# EAGLE design EthernetShield (EAGLE 5.11)
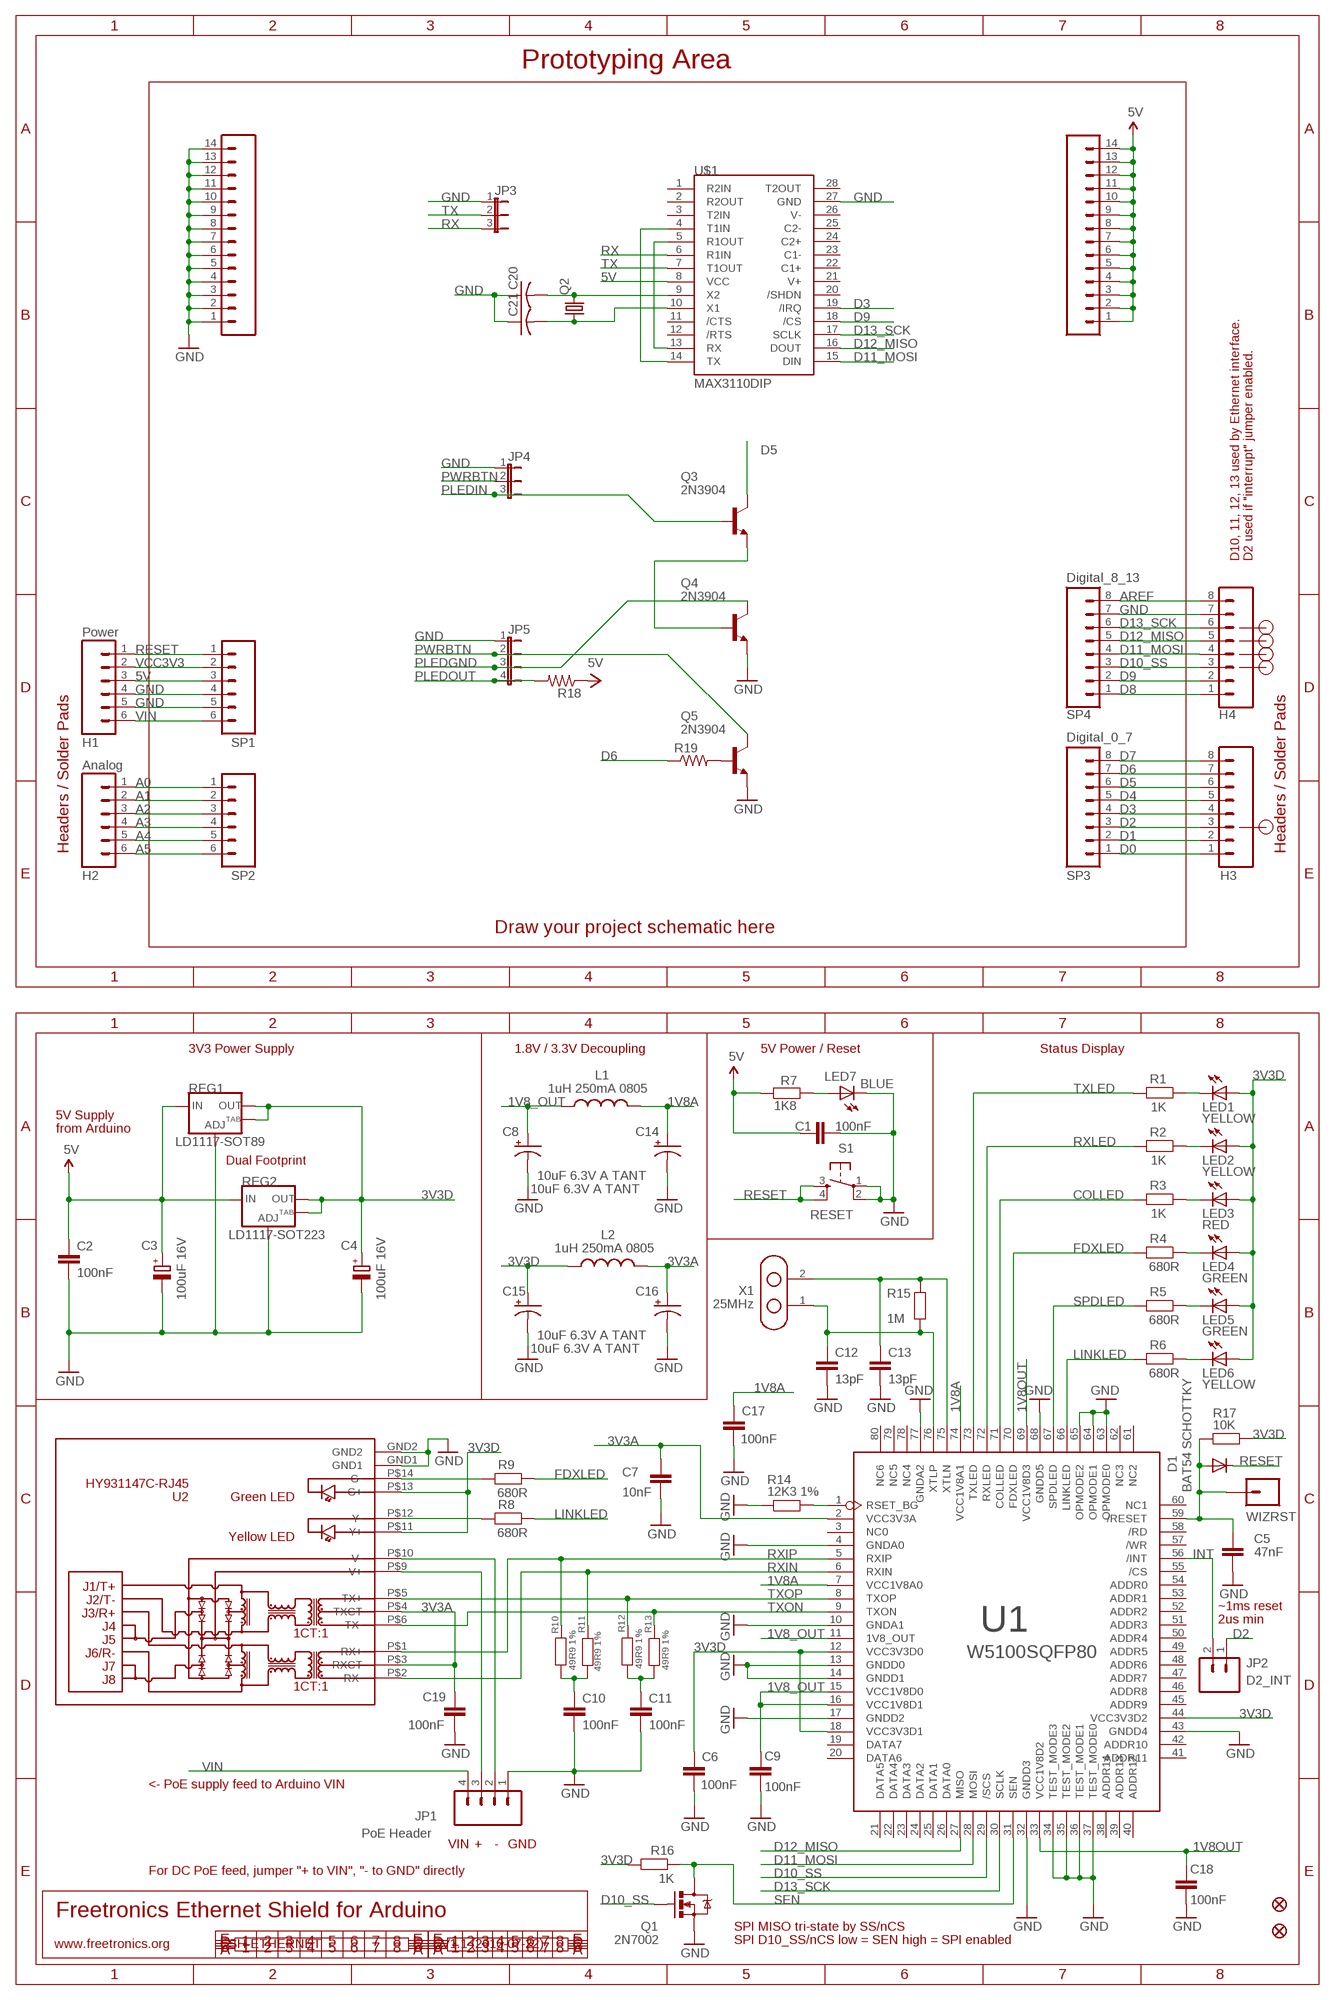
[diagram p0: schematic, sheet 1]

## Parts
C1  100nF  CAP0603  [0603]
C2  100nF  CAP0603  [0603]
C3  100uF 16V  CPOL-EUD  [PANASONIC_D]
C4  100uF 16V  CPOL-EUD  [PANASONIC_D]
C5  47nF  CAP0603  [0603]
C6  100nF  CAP0603  [0603]
C7  10nF  CAP0603  [0603]
C8  10uF 6.3V A TANT  CAP_POL1206  [EIA3216]
C9  100nF  CAP0603  [0603]
C10  100nF  CAP0603  [0603]
C11  100nF  CAP0603  [0603]
C12  13pF  CAP0603  [0603]
C13  13pF  CAP0603  [0603]
C14  10uF 6.3V A TANT  CAP_POL1206  [EIA3216]
C15  10uF 6.3V A TANT  CAP_POL1206  [EIA3216]
C16  10uF 6.3V A TANT  CAP_POL1206  [EIA3216]
C17  100nF  CAP0603  [0603]
C18  100nF  CAP0603  [0603]
C19  100nF  CAP0603  [0603]
C20  C-US050-025X075  [C050-025X075]
C21  C-US050-025X075  [C050-025X075]
D1  BAT54 SCHOTTKY  DIODESOT23  [SOT23-3]
H1  Power  M06SIP  [1X06]
H2  Analog  M06SIP  [1X06]
H3  Digital_0_7  M08  [1X08]
H4  Digital_8_13  M08  [1X08]
JP1  PoE Header  M04PTH  [1X04]
JP2  D2_INT  M02PTH  [1X02]
JP3  JP2E  [JP2]
JP4  JP2E  [JP2]
JP5  JP4E  [JP4]
L1  1uH 250mA 0805  L-USL2012C  [L2012C]
L2  1uH 250mA 0805  L-USL2012C  [L2012C]
LED1  YELLOW  LED0603  [LED-0603]
LED2  YELLOW  LED0603  [LED-0603]
LED3  RED  LED0603  [LED-0603]
LED4  GREEN  LED0603  [LED-0603]
LED5  GREEN  LED0603  [LED-0603]
LED6  YELLOW  LED0603  [LED-0603]
LED7  BLUE  LED0603  [LED-0603]
PADS_5V  M14  [1X14]
PADS_GND  M14  [1X14]
Q1  2N7002  MOSFET-NCHANNELSMD  [SOT23-3]
Q2  CRYSTALHC49U-V  [HC49U-V]
Q3  2N3904  [TO92]
Q4  2N3904  [TO92]
Q5  2N3904  [TO92]
R1  1K  RESISTOR0603  [0603]
R2  1K  RESISTOR0603  [0603]
R3  1K  RESISTOR0603  [0603]
R4  680R  RESISTOR0603  [0603]
R5  680R  RESISTOR0603  [0603]
R6  680R  RESISTOR0603  [0603]
R7  1K8  RESISTOR0603  [0603]
R8  680R  RESISTOR0603  [0603]
R9  680R  RESISTOR0603  [0603]
R10  49R9 1%  RESISTOR0603  [0603]
R11  49R9 1%  RESISTOR0603  [0603]
R12  49R9 1%  RESISTOR0603  [0603]
R13  49R9 1%  RESISTOR0603  [0603]
R14  12K3 1%  RESISTOR0603  [0603]
R15  1M  RESISTOR0603  [0603]
R16  1K  RESISTOR0603  [0603]
R17  10K  RESISTOR0603  [0603]
R18  R-US_0204/5  [0204/5]
R19  R-US_0204/5  [0204/5]
REG1  LD1117-SOT89  V_REG_LM1117SOT89  [SOT89]
REG2  LD1117-SOT223  V_REG_LM1117SOT223  [SOT223]
S1  RESET  TAC_SWITCHSMD  [TACTILE_SWITCH_SMD]
SP1  Power  M06SIP  [1X06]
SP2  Analog  M06SIP  [1X06]
SP3  Digital_0_7  M08  [1X08]
SP4  Digital_8_13  M08  [1X08]
U1  W5100SQFP80  [SQFP80]
U2  HY931147C-RJ45  [HY931147C]
U$1  MAX3110DIP  [DIL28-3]
U$6  FIDUCIAL1X2.5  [FIDUCIAL-1X2.5]
U$8  FIDUCIAL1X2.5  [FIDUCIAL-1X2.5]
WIZRST  M01PTH  [1X01]
X1  25MHz  XTL_B  [XTL_B]

## Nets
1V8_OUT: C8.A(+) C9.1 L1.1 U1.11(1V8_OUT) U1.15(VCC1V8D0) U1.16(VCC1V8D1)
1V8A: C14.A(+) C17.1 L1.2 U1.7(VCC1V8A0) U1.74(VCC1V8A1)
1V8OUT: C18.1 U1.33(VCC1V8D2) U1.69(VCC1V8D3)
3V3A: C7.1 C16.A(+) C19.1 L2.2 U1.2(VCC3V3A) U2.P$3(RXCT) U2.P$4(TXCT)
3V3D: C4.+ C6.1 C15.A(+) L2.1 LED1.A LED2.A LED3.A LED4.A LED5.A LED6.A R16.2 R17.1 REG1.2(OUT) REG1.4(OUT) REG2.2(OUT) REG2.4(OUT) U1.12(VCC3V3D0) U1.18(VCC3V3D1) U1.44(VCC3V3D2) U2.P$11(Y+) U2.P$13(G+)
5V: C1.1 C2.1 C3.+ H1.3 PADS_5V.1 PADS_5V.2 PADS_5V.3 PADS_5V.4 PADS_5V.5 PADS_5V.6 PADS_5V.7 PADS_5V.8 PADS_5V.9 PADS_5V.10 PADS_5V.11 PADS_5V.12 PADS_5V.13 PADS_5V.14 R7.1 REG1.3(IN) REG2.3(IN) SP1.3 U$1.8(VCC)
A0: H2.1 SP2.1
A1: H2.2 SP2.2
A2: H2.3 SP2.3
A3: H2.4 SP2.4
A4: H2.5 SP2.5
A5: H2.6 SP2.6
AREF: H4.8 SP4.8
COLLED: R3.2 U1.71(COLLED)
D0: H3.1 SP3.1
D1: H3.2 SP3.2
D2: H3.3 JP2.1 SP3.3
D3: H3.4 SP3.4 U$1.19(/IRQ)
D4: H3.5 SP3.5
D5: H3.6 Q3.1(C) SP3.6
D6: H3.7 R19.1 SP3.7
D7: H3.8 SP3.8
D8: H4.1 SP4.1
D9: H4.2 SP4.2 U$1.18(/CS)
D10_SS: H4.3 Q1.1(G) SP4.3 U1.29(/SCS)
D11_MOSI: H4.4 SP4.4 U1.28(MOSI) U$1.15(DIN)
D12_MISO: H4.5 SP4.5 U1.27(MISO) U$1.16(DOUT)
D13_SCK: H4.6 SP4.6 U1.30(SCLK) U$1.17(SCLK)
FDXLED: R4.2 R9.1 U1.70(FDXLED)
GND: C1.2 C2.2 C3.- C4.- C5.2 C6.2 C7.2 C8.C(-) C9.2 C10.2 C11.2 C12.2 C13.2 C14.C(-) C15.C(-) C16.C(-) C17.2 C18.2 C19.2 C20.1 C21.1 H1.4 H1.5 H4.7 JP1.1 JP3.1 JP4.1 JP5.1 LED7.C PADS_GND.1 PADS_GND.2 PADS_GND.3 PADS_GND.4 PADS_GND.5 PADS_GND.6 PADS_GND.7 PADS_GND.8 PADS_GND.9 PADS_GND.10 PADS_GND.11 PADS_GND.12 PADS_GND.13 PADS_GND.14 Q1.2(S) Q4.3(E) Q5.3(E) R14.1 REG1.1(ADJ) REG2.1(ADJ) S1.1 S1.2 SP1.4 SP1.5 SP4.7 U1.4(GNDA0) U1.10(GNDA1) U1.13(GNDD0) U1.14(GNDD1) U1.17(GNDD2) U1.32(GNDD3) U1.34(TEST_MODE3) U1.35(TEST_MODE2) U1.36(TEST_MODE1) U1.37(TEST_MODE0) U1.43(GNDD4) U1.63(OPMODE0) U1.64(OPMODE1) U1.65(OPMODE2) U1.68(GNDD5) U1.77(GNDA2) U2.GND1 U2.GND2 U$1.27(GND)
INT: JP2.2 U1.56(/INT)
LINKLED: R6.2 R8.1 U1.66(LINKLED)
N$1: C11.1 R12.1 R13.2
N$2: U$1.4(T1IN) U$1.14(TX)
N$6: U$1.5(R1OUT) U$1.13(RX)
N$7: C20.2 Q2.2 U$1.9(X2)
N$53: C21.2 Q2.1 U$1.10(X1)
N$54: Q3.3(E) Q4.2(B)
N$55: Q5.2(B) R19.2
N$67: R9.2 U2.P$14(G-)
N$68: JP1.3 U2.P$9(V+)
N$69: JP1.2 U2.P$10(V-)
N$70: C5.1 D1.1(A) R17.2 U1.59(/RESET) WIZRST.1
N$131: LED7.A R7.2
N$321: C10.1 R10.1 R11.2
N$322: R14.2 U1.1(RSET_BG)
N$323: LED5.C R5.1
N$325: LED6.C R6.1
N$327: LED4.C R4.1
N$328: LED3.C R3.1
N$329: LED2.C R2.1
N$330: LED1.C R1.1
N$332: R8.2 U2.P$12(Y-)
PLEDGND: JP5.3 Q4.1(C)
PLEDIN: JP4.3 Q3.2(B)
PLEDOUT: JP5.4 R18.2
PWRBTN: JP4.2 JP5.2 Q5.1(C)
RESET: D1.3(C) H1.1 S1.3 S1.4 SP1.1
RX: JP3.3 U$1.6(R1IN)
RXIN: R11.1 U1.6(RXIN) U2.P$2(RX-)
RXIP: R10.2 U1.5(RXIP) U2.P$1(RX+)
RXLED: R2.2 U1.72(RXLED)
SEN: Q1.3(D) R16.1 U1.31(SEN)
SPDLED: R5.2 U1.67(SPDLED)
TX: JP3.2 U$1.7(T1OUT)
TXLED: R1.2 U1.73(TXLED)
TXON: R13.1 U1.9(TXON) U2.P$6(TX-)
TXOP: R12.2 U1.8(TXOP) U2.P$5(TX+)
VCC: R18.1 ; supply symbol labelled 5V
VCC3V3: H1.2 SP1.2
VIN: H1.6 JP1.4 SP1.6
XTLN: C13.1 R15.2 U1.75(XTLN) X1.2
XTLP: C12.1 R15.1 U1.76(XTLP) X1.1
Unconnected: U1.3(NC0) U1.19(DATA7) U1.20(DATA6) U1.21(DATA5) U1.22(DATA4) U1.23(DATA3) U1.24(DATA2) U1.25(DATA1) U1.26(DATA0) U1.38(ADDR14) U1.39(ADDR13) U1.40(ADDR12) U1.41(ADDR11) U1.42(ADDR10) U1.45(ADDR9) U1.46(ADDR8) U1.47(ADDR7) U1.48(ADDR6) U1.49(ADDR5) U1.50(ADDR4) U1.51(ADDR3) U1.52(ADDR2) U1.53(ADDR1) U1.54(ADDR0) U1.55(/CS) U1.57(/WR) U1.58(/RD) U1.60(NC1) U1.61(NC2) U1.62(NC3) U1.78(NC4) U1.79(NC5) U1.80(NC6) U$1.1(R2IN) U$1.2(R2OUT) U$1.3(T2IN) U$1.11(/CTS) U$1.12(/RTS) U$1.20(/SHDN) U$1.21(V+) U$1.22(C1+) U$1.23(C1-) U$1.24(C2+) U$1.25(C2-) U$1.26(V-) U$1.28(T2OUT)

## Notes on the sheet
- Prototyping Area
- D10, 11, 12, 13 used by Ethernet interface. | D2 used if "interrupt" jumper enabled.
- Headers / Solder Pads | Headers / Solder Pads
- Draw your project schematic here
- 3V3 Power Supply | 1.8V / 3.3V Decoupling | 5V Power / Reset | Status Display
- 5V Supply
- from Arduino
- Dual Footprint
- ~1ms reset
- 2us min
- <- PoE supply feed to Arduino VIN
- VIN | + | - | GND
- For DC PoE feed, jumper "+ to VIN", "- to GND" directly
- Freetronics Ethernet Shield for Arduino
- SPI MISO tri-state by SS/nCS
- SPI D10_SS/nCS low = SEN high = SPI enabled
- www.freetronics.org | SH-ETHERNET | V1.1 (2010-07-22)

## Library data of the parts
C1 C2 C5-C7 C9-C13 C17-C19 = freetronics:CAP: Capacitor Standard 0603 ceramic capacitor, and 0.1" leaded capacitor.
C3 C4 = rcl:CPOL-EU: POLARIZED CAPACITOR, European symbol
C8 C14-C16 = freetronics:CAP_POL: Capacitor Polarized These are standard SMD and PTH capacitors. Normally 10uF, 47uF, and 100uF in electrolytic and tantalum varieties. Always verify the external diameter of the through hole cap, it varies with capacity, voltage, and manufacturer. The EIA devices should be standard.
C20 C21 = rcl-2:C-US: CAPACITOR, American symbol
D1 = freetronics:DIODE: Diode These are standard reverse protection diodes and small signal diodes. SMA package can handle up to about 1A. SOD-323 can handle about 200mA. What the SOD-323 package when ordering, there are some mfgs out there that are 5-pin packages.
H1 H2 SP1 SP2 = freetronics:M06: Header 6 Standard 6-pin 0.1" header. Use with straight break away headers (SKU : PRT-00116), right angle break away headers (PRT-00553), swiss pins (PRT-00743), machine pins (PRT-00117), and female headers (PRT-00115). Molex polarized connector foot print use with SKU : PRT-08094 with associated crimp pins and housings. NOTES ON THE VARIANTS LOCK and LOCK_LONGPADS... This footprint was designed to help hold the alignment of a through-hole component (i.e. 6-pin header) while soldering it into place. You may notice that each hole has been shifted either up or down by 0.005 of an inch from it's more standard position (which is a perfectly straight line). This slight alteration caused the pins (the squares in the middle) to touch the edges of the holes. Because they are alternating, it causes a "brace" to hold the component in place. 0.005 has proven to be the perfect amount of "off-center" position when using our standard breakaway headers. Although looks a little odd when you look at the bare footprint, once you have a header in there, the alteration is very hard to notice. Also, if you push a header all the way into place, it is covered up entirely on the bottom side. This idea of altering the position of holes to aid alignment will be further integrated into the Sparkfun Library for other footprints. It can help hold any component with 3 or more connection pins.
H3 H4 SP3 SP4 = freetronics:M08: Header 8 Standard 8-pin 0.1" header. Use with straight break away headers (SKU : PRT-00116), right angle break away headers (PRT-00553), swiss pins (PRT-00743), machine pins (PRT-00117), and female headers (PRT-00115).
JP1 = freetronics:M04: Header 4 Standard 4-pin 0.1" header. Use with straight break away headers (SKU : PRT-00116), right angle break away headers (PRT-00553), swiss pins (PRT-00743), machine pins (PRT-00117), and female headers (PRT-00115). Molex polarized connector foot print use with SKU : PRT-08231 with associated crimp pins and housings.
JP2 = freetronics:M02: Header 2 Standard 2-pin 0.1" header. Use with straight break away headers (SKU : PRT-00116), right angle break away headers (PRT-00553), swiss pins (PRT-00743), machine pins (PRT-00117), and female headers (PRT-00115). Molex polarized connector foot print use with SKU : PRT-08233 with associated crimp pins and housings.
JP3 JP4 = jumper:JP2E: JUMPER
JP5 = jumper:JP4E: JUMPER
L1 L2 = rcl:L-US: INDUCTOR, American symbol
LED1-LED7 = freetronics:LED: LEDs Standard schematic elements and footprints for 5mm, 3mm, 1206, and 0603 sized LEDs. 5mm - Spark Fun Electronics SKU : COM-00529 (and others)
PADS_5V PADS_GND = freetronics:M14: Header 14 Standard 14-pin 0.1" header. Use with straight break away headers (SKU : PRT-00116), right angle break away headers (PRT-00553), swiss pins (PRT-00743), machine pins (PRT-00117), and female headers (PRT-00115).
Q1 = freetronics:MOSFET-NCHANNEL
Q2 = crystal:CRYSTAL: CRYSTAL
Q3-Q5 = transistor-npn:2N3904: NPN Transistor
R1-R17 = freetronics:RESISTOR: Resistor Basic schematic elements and footprints for 0603, 1206, and PTH 1/10th watt (small) resistors.
R18 R19 = resistor:R-US_: RESISTOR, American symbol
REG1 REG2 = freetronics:V_REG_LM1117: Voltage Regulator LD1117 Adjustable low-dropout voltage regulator available in SOT89 and SOT223 SMT packages.
S1 = freetronics:TAC_SWITCH: Momentary Switch Button commonly used for reset or general input. Spark Fun Electronics SKU : COM-00097
U1 = freetronics-marc:W5100: WIZnet W5100
U2 = freetronics-jon:HY931147C
U$1 = 000-kg4wsv:MAX3110: MAX3110 SPI UART w/RS232 tranceiver
U$6 U$8 = freetronics:FIDUCIAL: Fiducial Alignment Points Various fiducial points for machine vision alignment.
WIZRST = freetronics:M01: Header 1 Standard 1-pin 0.1" header. Use with straight break away headers (SKU : PRT-00116), right angle break away headers (PRT-00553), swiss pins (PRT-00743), machine pins (PRT-00117), and female headers (PRT-00115).
X1 = CPT_CJ:XTL_B

## Board
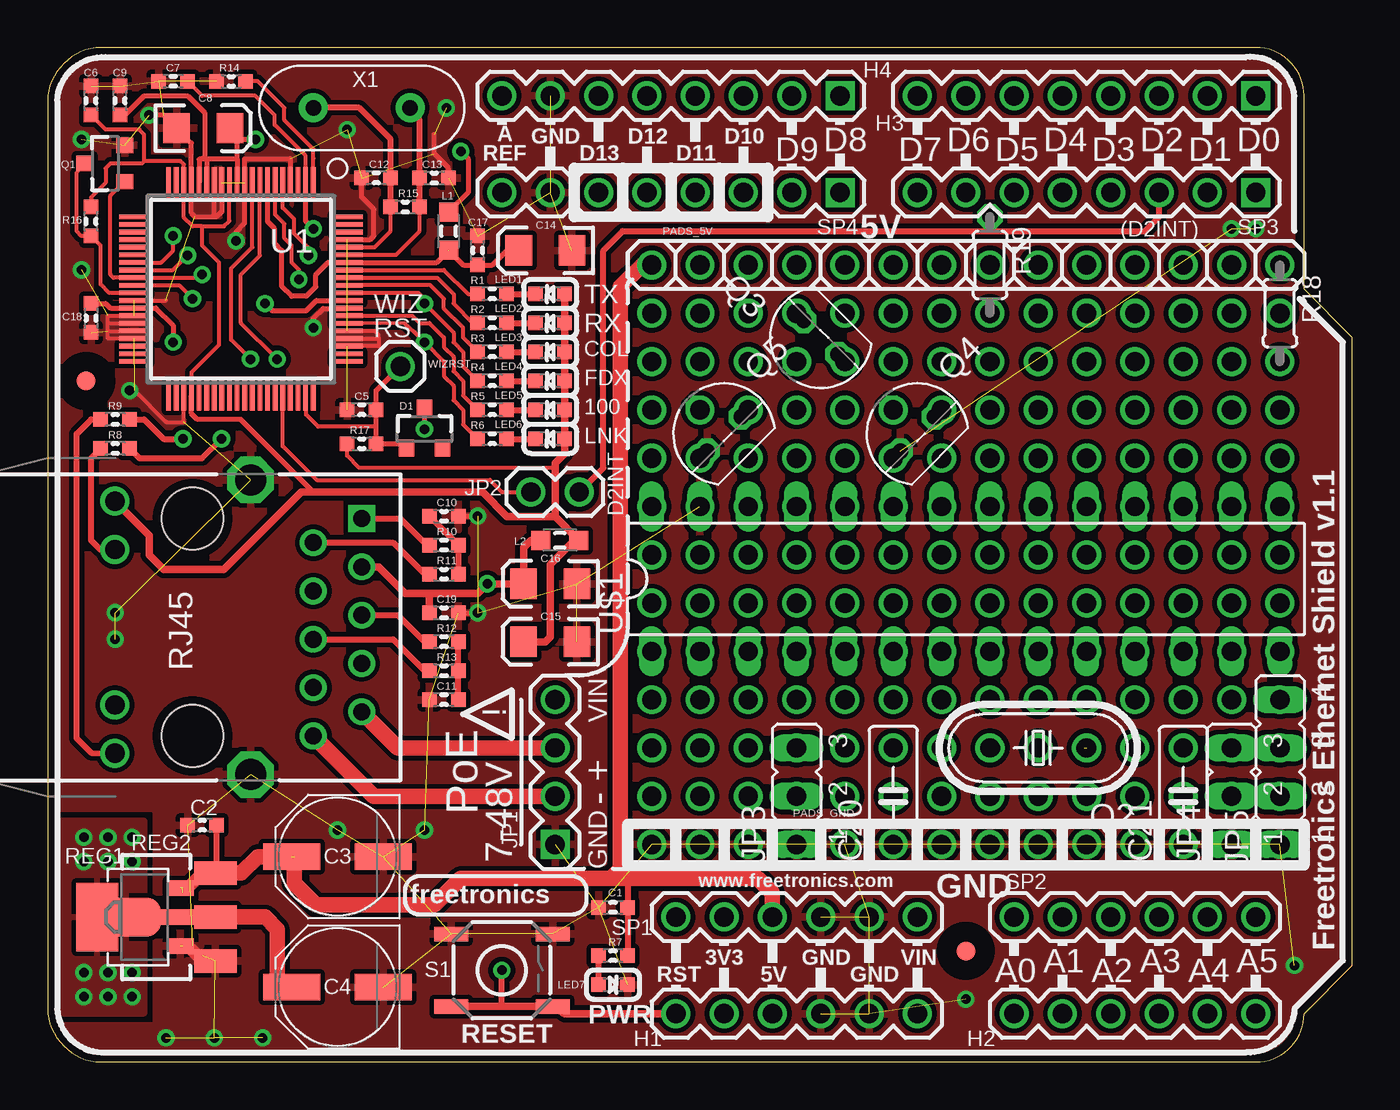
[diagram p1: board, top side]
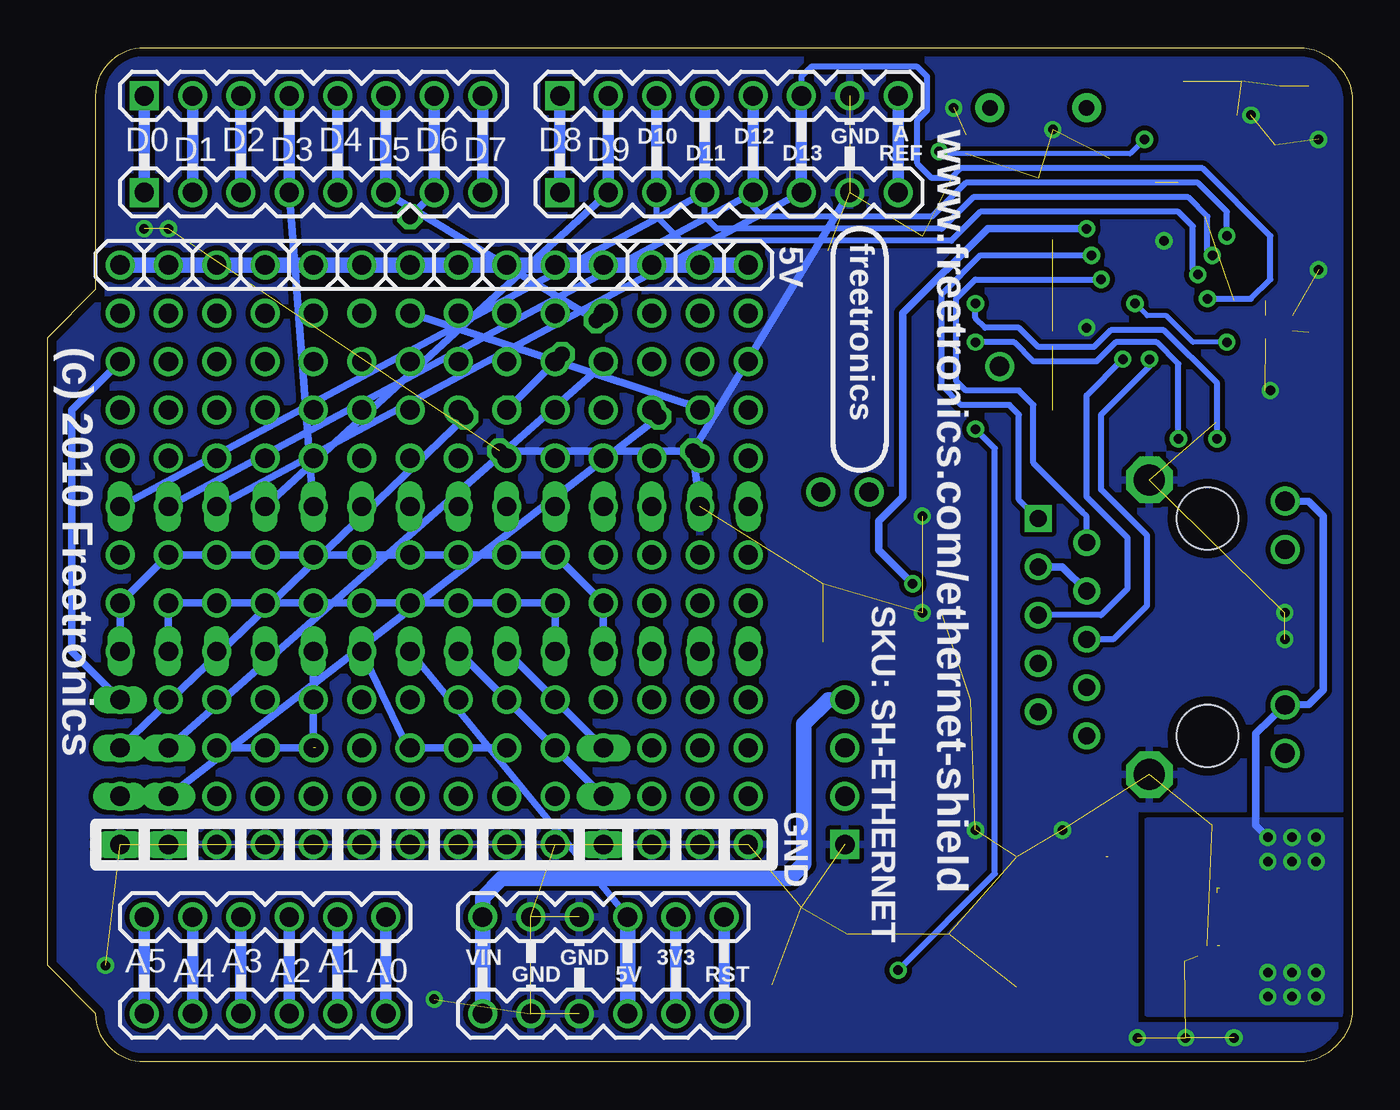
[diagram p2: board, bottom side, seen from below]

Size 68.58 x 53.34 mm. Coordinates in mm from the lower left corner, seen from the top.
Outline: 0,2.54 arc74 2.54,0 63.5,0 arc90 66.04,2.54 68.58,5.08 68.58,38.1 66.04,40.64 66.04,50.8 arc90 63.5,53.34 2.54,53.34 arc74 0,50.8 0,2.54
Copper layers (1*16): Top 0.035mm / dielectric 1.5mm / Bottom 0.035mm
Design rules "default *": minimum track width 8mil, minimum drill 18mil, track to track 10mil, track to pad 10mil, pad to pad 10mil, via to via 10mil, smd to smd 8mil, copper to edge 18mil, drill to drill 8mil, minimum pad ring 10mil, minimum via ring 8mil, stop-mask expansion 4mil, vias tented up to drill 25mil, thermal gap 10mil
tRestrict: area 1,34.8 to 3,36.8; area 47.2,4.8 to 49.3,6.9

### Footprints (pad centres in the part's own frame; a part is rotated, then mirrored left to right if it is on the bottom)
0603 = smd 0.762 x 0.762: 1 -0.762,0; 2 0.762,0
PANASONIC_D = smd 3 x 1.4: + 2.4,0; - -2.4,0
EIA3216 = smd 1.4 x 1.6: A 1.4,0; C -1.4,0
C050-025X075 = drill 0.813 octagon: 1 -2.54,0; 2 2.54,0
SOT23-3 = smd 0.8 x 0.9: 1 -0.95,-1; 2 0.95,-1; 3 0,1.1
1X06 = drill 1.016 round: 1 0,0; 2 2.54,0; 3 5.08,0; 4 7.62,0; 5 10.16,0; 6 12.7,0
1X08 = drill 1.016 square: 1 0,0 | drill 1.016 round: 2 2.54,0; 3 5.08,0; 4 7.62,0; 5 10.16,0; 6 12.7,0; 7 15.24,0; 8 17.78,0
1X04 = drill 1.016 square: 1 0,0 | drill 1.016 round: 2 2.54,0; 3 5.08,0; 4 7.62,0
1X02 = drill 1.016 round: 1 0,0; 2 2.54,0
JP2 = drill 0.914 long: 1 -2.54,0; 2 0,0; 3 2.54,0
JP4 = drill 0.914 long: 1 -3.81,0; 2 -1.27,0; 3 1.27,0; 4 3.81,0
L2012C = smd 1 x 1: 1 -1,0; 2 1,0
LED-0603 = smd 0.762 x 0.762: A -0.762,0; C 0.762,0
1X14 = drill 1.016 round: 1 0,0; 2 2.54,0; 3 5.08,0; 4 7.62,0; 5 10.16,0; 6 12.7,0; 7 15.24,0; 8 17.78,0; 9 20.32,0; 10 22.86,0; 11 25.4,0; 12 27.94,0; 13 30.48,0; 14 33.02,0
HC49U-V = drill 0.813 round: 1 -2.413,0; 2 2.413,0
TO92 = drill 0.813 octagon: 1 1.27,0; 2 0,1.905; 3 -1.27,0
0204/5 = drill 0.813 octagon: 1 -2.54,0; 2 2.54,0
SOT89 = smd 0.8 x 1.4: 1 -1.524,-1.905; 3 1.524,-1.905 | smd 0.8 x 1.9: 2 0,-1.651 | smd 2.032 x 3.65: 4 0,0.94
SOT223 = smd 1.219 x 2.235: 1 -2.311,-3.099; 2 0,-3.099; 3 2.311,-3.099 | smd 3.6 x 2.2: 4 0,3.099
TACTILE_SWITCH_SMD = smd 1.778 x 0.762: 1 -2.667,1.905; 2 2.667,1.905; 3 -2.667,-1.905; 4 2.667,-1.905
SQFP80 = smd 1.6 x 0.25: 1 -5.6,3.8; 2 -5.6,3.4; 3 -5.6,3; 4 -5.6,2.6; 5 -5.6,2.2; 6 -5.6,1.8; 7 -5.6,1.4; 8 -5.6,1; 9 -5.6,0.6; 10 -5.6,0.2; 11 -5.6,-0.2; 12 -5.6,-0.6; 13 -5.6,-1; 14 -5.6,-1.4; 15 -5.6,-1.8; 16 -5.6,-2.2; 17 -5.6,-2.6; 18 -5.6,-3; 19 -5.6,-3.4; 20 -5.6,-3.8; 41 5.6,-3.8; 42 5.6,-3.4; 43 5.6,-3; 44 5.6,-2.6; 45 5.6,-2.2; 46 5.6,-1.8; 47 5.6,-1.4; 48 5.6,-1; 49 5.6,-0.6; 50 5.6,-0.2; 51 5.6,0.2; 52 5.6,0.6; 53 5.6,1; 54 5.6,1.4; 55 5.6,1.8; 56 5.6,2.2; 57 5.6,2.6; 58 5.6,3; 59 5.6,3.4; 60 5.6,3.8 | smd 0.25 x 1.6: 21 -3.8,-5.6; 22 -3.4,-5.6; 23 -3,-5.6; 24 -2.6,-5.6; 25 -2.2,-5.6; 26 -1.8,-5.6; 27 -1.4,-5.6; 28 -1,-5.6; 29 -0.6,-5.6; 30 -0.2,-5.6; 31 0.2,-5.6; 32 0.6,-5.6; 33 1,-5.6; 34 1.4,-5.6; 35 1.8,-5.6; 36 2.2,-5.6; 37 2.6,-5.6; 38 3,-5.6; 39 3.4,-5.6; 40 3.8,-5.6; 61 3.8,5.6; 62 3.4,5.6; 63 3,5.6; 64 2.6,5.6; 65 2.2,5.6; 66 1.8,5.6; 67 1.4,5.6; 68 1,5.6; 69 0.6,5.6; 70 0.2,5.6; 71 -0.2,5.6; 72 -0.6,5.6; 73 -1,5.6; 74 -1.4,5.6; 75 -1.8,5.6; 76 -2.2,5.6; 77 -2.6,5.6; 78 -3,5.6; 79 -3.4,5.6; 80 -3.8,5.6
HY931147C = drill 1.63 octagon: GND1 3.05,7.745; GND2 3.05,-7.745 | drill 0.9 square: P$1 8.89,5.715 | drill 0.9 round: P$2 6.35,4.445; P$3 8.89,3.175; P$4 6.35,1.905; P$5 8.89,0.635; P$6 6.35,-0.635; P$7 8.89,-1.905; P$8 6.35,-3.175; P$9 8.89,-4.445; P$10 6.35,-5.715 | drill 1.016 round: P$11 -4.08,6.625; P$12 -4.08,4.085; P$13 -4.08,-4.085; P$14 -4.08,-6.625 | hole 3.25: 0,5.715; 0,-5.715
DIL28-3 = drill 0.813 long: 1 -16.51,-3.81; 2 -13.97,-3.81; 3 -11.43,-3.81; 4 -8.89,-3.81; 5 -6.35,-3.81; 6 -3.81,-3.81; 7 -1.27,-3.81; 8 1.27,-3.81; 9 3.81,-3.81; 10 6.35,-3.81; 11 8.89,-3.81; 12 11.43,-3.81; 13 13.97,-3.81; 14 16.51,-3.81; 15 16.51,3.81; 16 13.97,3.81; 17 11.43,3.81; 18 8.89,3.81; 19 6.35,3.81; 20 3.81,3.81; 21 1.27,3.81; 22 -1.27,3.81; 23 -3.81,3.81; 24 -6.35,3.81; 25 -8.89,3.81; 26 -11.43,3.81; 27 -13.97,3.81; 28 -16.51,3.81
FIDUCIAL-1X2.5 = smd 1 x 1: 1 0,0
1X01 = drill 1.016 round: 1 0,0
XTL_B = drill 0.813 pad 1.524 round: 1 0,2.54; 2 0,-2.54

### Placement (x,y rotation side)
C1  29.72,8.13 180 top
C2  8.13,12.45 180 top
C3  15.24,10.79 180 top
C4  15.24,3.94 180 top
C5  16.51,34.29 180 top
C6  2.29,50.55 90 top
C7  6.6,51.56 180 top
C8  8.18,49.1 0 top
C9  3.81,50.55 90 top
C10  20.83,28.7 0 top
C11  20.83,19.05 180 top
C12  17.27,46.48 180 top
C13  20.32,46.48 0 top
C14  26.16,42.67 180 top
C15  26.42,22.1 180 top
C16  26.42,25.15 180 top
C17  22.61,42.67 90 top
C18  2.29,39.12 270 top
C19  20.83,23.62 0 top
C20  44.45,13.97 90 top
C21  59.69,13.97 90 top
D1  19.81,33.27 0 top
H1  33.02,2.54 0 top
H2  50.8,2.54 0 top
H3  63.5,50.8 180 top
H4  41.66,50.8 180 top
JP1  26.67,11.43 90 top
JP2  27.94,29.97 180 top
JP3  39.37,13.97 90 top
JP4  62.23,13.97 90 top
JP5  64.77,15.24 90 top
L1  21.08,43.69 270 top
L2  26.92,27.43 180 top
LED1  26.42,40.39 180 top
LED2  26.42,38.86 180 top
LED3  26.42,37.34 180 top
LED4  26.42,35.81 180 top
LED5  26.42,34.29 180 top
LED6  26.42,32.77 180 top
LED7  29.72,4.06 0 top
PADS_5V  31.75,41.91 0 top
PADS_GND  31.75,11.43 0 top
Q1  3.05,47.24 90 top
Q2  52.07,16.51 180 top
Q3  40.64,38.1 135 top
Q4  45.72,33.02 45 top
Q5  35.56,33.02 45 top
R1  23.37,40.39 180 top
R2  23.37,38.86 180 top
R3  23.37,37.34 180 top
R4  23.37,35.81 180 top
R5  23.37,34.29 180 top
R6  23.37,32.77 180 top
R7  29.72,5.59 180 top
R8  3.56,32.26 180 top
R9  3.56,33.78 180 top
R10  20.83,27.18 180 top
R11  20.83,25.65 0 top
R12  20.83,22.1 180 top
R13  20.83,20.57 0 top
R14  9.65,51.56 0 top
R15  18.8,44.96 0 top
R16  2.29,44.2 90 top
R17  16.51,32.51 0 top
R18  64.77,39.37 270 top
R19  49.53,41.91 270 top
REG1  5.08,7.62 90 top
REG2  5.71,7.62 90 top
S1  23.88,4.83 0 top
SP1  33.02,7.62 0 top
SP2  50.8,7.62 0 top
SP3  63.5,45.72 180 top
SP4  41.66,45.72 180 top
U1  10.16,40.64 270 top
U2  7.62,22.86 0 top
U$1  48.26,25.4 0 top
U$6  2.03,35.81 0 top
U$8  48.26,5.84 0 top
WIZRST  18.54,36.58 0 top
X1  16.51,50.16 90 top

### Tracks (layer width: path | path; a pad name or v marks a point on that pad's centre or on a via)
1V8_OUT  (via drill 0.5)
  Top 0.254: C9.1 4.06,49.78 5.08,50.8 7.37,50.8 8.26,49.91 8.26,47.47 | 8.26,47.47 7.96,47.46 U1.16 | 9.96,47.5 U1.11 | 9.96,47.5 9.96,48.84 C8.A 10.16,48.51 v10.92,48.51 | 8.23,47.5 8.36,47.5 | 8.36,47.5 9.96,47.5 | U1.15 8.36,47.5 | L1.1 21.08,44.7 22.1,45.72 22.1,47.5 v21.72,47.88 | 8.26,47.47 8.23,47.5 | 8.23,47.5 8.13,47.5
  Bottom 0.254: v10.92,48.51 11.68,47.75 21.59,47.75 v21.72,47.88
1V8A  (1 unrouted)
  Top 0.254: C14.A 24.13,42.67 23.37,41.91 C17.1 21.84,41.91 21.08,42.67 20.45,42.04 U1.74 14.73,42.04 14.1,41.4 14.1,40.77 13.59,40.26 12.83,40.26 12.32,40.77 12.32,42.67 11.94,43.05 11.94,43.81 11.56,44.19 U1.7
1V8OUT  (via drill 0.5)
  Top 0.254: C18.1 3.05,39.88 3.29,39.64 U1.33 5.69,39.65 6.6,38.73 v6.6,37.85 | U1.69 14.13,40.04 13.59,39.5 11.81,39.5 v11.43,39.88
  Bottom 0.254: v11.43,39.88 10.79,39.24 9.78,39.24 8.38,37.85 v6.6,37.85
3V3A  (via drill 0.5)
  Top 0.203: U1.2 13.56,46.27 13.56,47.65 11.94,49.28 11.94,49.78 10.92,50.8 8.13,50.8 C7.1
  Top 0.254: U1.2 13.56,44.22 v13.97,43.81
  Top 0.406: L2.2 25.4,27.43 25.02,27.05 C16.A v23.11,25.15 22.61,24.64 20.07,24.64 | U2.P$3 17.4,26.04 18.8,24.64 20.07,24.64 | 20.07,24.64 C19.1
  Bottom 0.406: U2.P$4 15.24,26.04 U2.P$3 | v13.97,43.81 19.18,43.81 23.62,39.37 23.62,29.72 24.89,28.45 24.89,26.92 v23.11,25.15
3V3D  (via drill 0.5)
  Top 0.203: U1.44 7.57,36.22 7.57,36.27 9.02,37.72 9.02,42.04 8.13,42.93 8.13,43.94 | C6.1 3.05,49.02 4.83,49.02 5.08,48.77 5.08,47.37 | 5.08,47.37 6.99,47.37 7.16,47.2 U1.18 7.16,44.4 7.62,43.94 8.13,43.94 | U1.12 9.55,44.22 9.27,43.94 8.13,43.94 | R16.2 2.29,45.47 3.05,46.23 3.05,46.99 3.3,47.24 4.95,47.24 5.08,47.37 | R17.1 15.75,31.88 16.38,31.24 26.67,31.24
  Top 0.254: 13.97,29.97 10.16,33.78 7.87,33.78 7.56,34.1 U1.44
  Top 0.406: LED1.A LED2.A LED3.A LED4.A LED5.A LED6.A 27.18,32 26.67,31.5 26.67,31.24 26.67,28.69 | REG1.4 REG1.2 REG2.2 | C15.A 26.16,22.1 26.42,22.35 26.42,26.16 27.69,27.43 L2.1 26.67,28.69 | U2.P$11 5.33,27.69 5.33,26.67 6.1,25.91 9.27,25.91 13.34,29.97 13.97,29.97 22.86,29.97 24.15,28.69 26.67,28.69
  Top 0.813: C4.+ 12.06,3.81 12.06,6.99 11.43,7.62 REG2.2
  Bottom 0.406: v4.45,11.81 5.08,12.45 5.08,17.27 U2.P$13 2.29,18.8 1.52,19.56 1.52,28.7 2.29,29.46 U2.P$11
  other vias: 1.91,11.81 1.91,3.43 4.45,3.43 1.91,10.54 1.91,4.7 4.45,10.54 4.45,4.7 3.17,3.43 3.17,4.7 3.17,10.54 3.17,11.81
  pour Top: 0,12.7 5.08,12.7 5.08,2.54 0,2.54
  pour Bottom: 0,12.7 10.79,12.7 10.79,2.54 0,2.54
5V  (3 unrouted)
  Top 0.254: 7.11,8.89 7.37,8.89 8.13,9.65 | 7.11,9.14 7.87,9.91
  Top 0.305: C2.1 8.89,10.41 8.81,10.41 REG2.3 | 30.48,9.65 C1.1 R7.1
  Top 0.406: REG1.3 REG2.3
  Top 0.61: 31.24,9.65 30.48,10.41 | 29.46,9.65 30.23,10.41
  Top 0.813: REG2.3 10.19,9.93 11.05,10.79 C3.+ | SP1.3 38.1,8.89 37.34,9.65 31.24,9.65 30.48,9.65 30.1,9.65 | 30.1,9.65 29.46,9.65 21.72,9.65 20.32,8.26 14.1,8.26 12.95,9.4 12.95,10.79 | 30.1,9.65 30.1,40.77 31.24,41.91 PADS_5V.1
  Bottom 0.406: SP1.3 U$1.8
  Bottom 0.813: SP1.3 H1.3 | PADS_5V.1 PADS_5V.2 PADS_5V.3 PADS_5V.4 PADS_5V.5 PADS_5V.6 PADS_5V.7 PADS_5V.8 PADS_5V.9 PADS_5V.10 PADS_5V.11 PADS_5V.12 PADS_5V.13 PADS_5V.14
A0
  Bottom 0.61: H2.1 SP2.1
A1
  Bottom 0.61: H2.2 SP2.2
A2
  Bottom 0.61: H2.3 SP2.3
A3
  Bottom 0.61: H2.4 SP2.4
A4
  Bottom 0.61: H2.5 SP2.5
A5
  Bottom 0.61: H2.6 SP2.6
AREF
  Bottom 0.61: SP4.8 H4.8
COLLED
  Top 0.203: U1.71 20.12,40.84 20.83,40.13 20.83,39.62 21.84,38.61 21.84,38.1 R3.2
D0
  Bottom 0.61: SP3.1 H3.1
D1
  Bottom 0.61: SP3.2 H3.2
D2
  Top 0.305: JP2.1 29.21,31.24 29.21,42.67 30.23,43.69 57.66,43.69 58.42,44.45 SP3.3
  Bottom 0.61: SP3.3 H3.3
D3
  Bottom 0.406: U$1.19 SP3.4
  Bottom 0.61: SP3.4 H3.4
D4
  Bottom 0.61: SP3.5 H3.5
D5
  Bottom 0.406: SP3.6 Q3.1
  Bottom 0.61: SP3.6 H3.6
D6
  Bottom 0.406: SP3.7 R19.1
  Bottom 0.61: SP3.7 H3.7
D7
  Bottom 0.61: SP3.8 H3.8
D8
  Bottom 0.61: SP4.1 H4.1
D9
  Bottom 0.406: U$1.18 SP4.2
  Bottom 0.61: SP4.2 H4.2
D10_SS  (via drill 0.5)
  Top 0.203: v8.13,41.4 7.9,41.24 U1.29 3.46,41.24 3.3,41.4 3.3,45.55 Q1.1
  Bottom 0.305: SP4.3 36.58,44.45 35.31,43.18 21.08,43.18 19.56,44.7 9.14,44.7 8.38,43.94 8.38,41.66 v8.13,41.4
  Bottom 0.61: SP4.3 H4.3
D11_MOSI  (via drill 0.5)
  Top 0.203: U1.28 6.58,41.64 v7.37,42.42
  Bottom 0.305: SP4.4 34.04,44.45 33.4,43.81 21.59,43.81 19.94,45.47 8.64,45.47 7.62,44.45 7.62,42.67 v7.37,42.42
  Bottom 0.406: SP4.4 U$1.15
  Bottom 0.61: SP4.4 H4.4
D12_MISO  (via drill 0.5)
  Top 0.203: U1.27 5.97,42.04 6.6,42.67 v6.6,43.43
  Bottom 0.305: SP4.5 31.5,44.96 30.99,44.45 22.1,44.45 20.32,46.23 8.13,46.23 6.6,44.7 v6.6,43.43
  Bottom 0.406: SP4.5 U$1.16
  Bottom 0.61: SP4.5 H4.5
D13_SCK  (via drill 0.5)
  Top 0.203: U1.30 6.91,40.84 v7.62,40.13
  Bottom 0.305: v7.62,40.13 5.33,40.13 4.32,41.15 4.32,43.43 7.87,46.99 20.57,46.99 21.08,46.48 22.1,46.48 22.86,47.24 22.86,49.53 22.35,50.04 22.35,51.82 22.86,52.32 28.45,52.32 28.96,51.82 H4.6
  Bottom 0.406: SP4.6 U$1.17
  Bottom 0.61: H4.6 SP4.6
FDXLED  (via drill 0.5)
  Top 0.203: U1.70 19.51,40.44 19.81,40.13 v19.81,39.88 21.34,38.35 21.34,37.85 21.84,37.34 21.84,36.58 R4.2
  Top 0.305: R9.1 5.08,33.78 6.1,32.77 v7.11,32.77
  Bottom 0.305: v7.11,32.77 7.11,35.69 9.91,38.48 12.7,38.48 13.59,37.59 16.51,37.59 17.53,38.61 19.3,38.61 19.81,39.12 v19.81,39.88
GND  (via drill 0.5)  (71 unrouted)
  Top 0.203: U1.32 6.22,40.04 | U1.43 7.16,33.66 6.22,33.66 4.57,35.31 v4.32,35.31 | U1.37 3.17,38.04 3.17,38.44 | U1.34 3.17,39.24 3.17,38.84 | 3.17,38.84 U1.35 | 3.17,38.44 U1.36 | 3.17,38.44 3.17,38.84 | U1.63 17.4,37.64 17.4,38.1 | 17.4,38.1 17.4,38.23 17.19,38.44 U1.65 | U1.64 17.34,38.04 arc90 17.4,38.1
  Top 0.254: U1.4 12.76,47.44 12.75,47.5 10.36,47.49 U1.10 | U1.77 16.95,43.24 17.14,43.43 17.14,44.83 16.51,45.47 C12.2 | v5.33,49.78 6.09,49.78 C8.C 7.56,48.32 U1.17 7.56,44.64 7.75,44.45 8.76,44.45 | U1.13 9.17,46.22 9.17,44.73 8.89,44.45 8.76,44.45 | U1.14 8.76,46.21 8.76,44.45 | 7.37,6.1 7.11,6.1 | 7.37,6.1 7.62,6.1 8.13,5.59 | 7.37,6.1 7.37,5.84 7.87,5.33 | C10.2 v22.61,28.7 | C19.2 v22.61,23.62 | 9.91,43.43 v9.91,43.18 9.91,43.64 10.36,44.09 U1.10 | C13.2 21.08,46.99 20.32,47.75 20.32,48.77 | U1.68 15.74,39.62 14.48,39.62 13.97,39.12 v13.97,38.61
  Bottom 0.406: U$1.27 Q5.3 | Q5.3 Q4.3 | SP4.7 Q5.3
  other vias: 8.76,1.27 6.22,1.27 11.3,1.27 65.53,5.08 48.26,3.3 15.24,12.19 15.75,49.02 1.78,48.51 1.78,41.66 20.95,50.16 63.5,43.81 62.23,43.81 3.56,23.62 3.56,22.23 19.81,12.19
  pour Bottom: 0,50.8 arc-74 2.54,53.34 63.5,53.34 arc-74 66.04,50.8 66.04,40.64 68.58,38.1 68.58,5.08 66.04,2.54 arc-74 63.5,0 2.54,0 arc-74 0,1.91 11.43,1.91 11.43,13.34 0,13.34
  pour Top: 0,50.8 arc-74 2.54,53.34 63.5,53.34 arc-74 66.04,50.8 66.04,40.64 68.58,38.1 68.58,5.08 66.04,2.54 arc-74 63.5,0 2.54,0 arc-74 0,1.91 5.71,1.91 5.71,13.34 0,13.34
INT
  Top 0.203: U1.56 12.36,32.38 14.13,30.61 23.24,30.61 23.88,29.97 JP2.2
LINKLED  (via drill 0.5)
  Top 0.203: U1.66 18.77,38.84 19.3,38.35 v19.81,37.85 20.83,36.83 20.83,36.07 21.34,35.56 21.34,34.8 21.84,34.29 21.84,33.53 R6.2
  Top 0.305: R8.1 4.83,31.75 8.13,31.75 v9.14,32.77
  Bottom 0.305: v9.14,32.77 9.14,36.7 10.29,37.85 12.45,37.85 13.46,36.83 16.76,36.83 17.78,37.85 v19.81,37.85 20.07,37.85
N$1
  Top 0.305: R12.1 R13.2 C11.1
N$2
  Bottom 0.406: U$1.14 64.77,24.13 62.23,26.67 41.91,26.67 39.37,24.13 U$1.4
N$3  (via drill 1.02)
  other vias: 36.83,13.97
N$4  (via drill 1.02)
  other vias: 34.29,13.97
N$5  (via drill 1.02)
  other vias: 59.69,13.97
N$6
  Bottom 0.406: U$1.13 62.23,24.13 41.91,24.13 U$1.5
N$7
  Bottom 0.406: C20.2 Q2.2 U$1.9
N$8  (via drill 1.02)
  other vias: 54.61,13.97
N$9  (via drill 1.02)
  other vias: 52.07,13.97
N$10  (via drill 1.02)
  other vias: 49.53,13.97
N$11  (via drill 1.02)
  other vias: 46.99,13.97
N$12  (via drill 1.02)
  other vias: 44.45,13.97
N$13  (via drill 1.02)
  other vias: 41.91,13.97
N$14  (via drill 1.02)
  other vias: 39.37,13.97
N$15  (via drill 1.02)
  other vias: 31.75,13.97
N$16  (via drill 1.02)
  other vias: 39.37,21.59
N$17  (via drill 1.02)
  other vias: 54.61,24.13
N$18  (via drill 1.02)
  other vias: 31.75,21.59
N$19  (via drill 1.02)
  other vias: 36.83,16.51
N$20  (via drill 1.02)
  other vias: 34.29,16.51
N$21  (via drill 1.02)
  other vias: 31.75,16.51
N$22  (via drill 1.02)
  other vias: 59.69,16.51
N$23  (via drill 1.02)
  other vias: 57.15,16.51
N$24  (via drill 1.02)
  other vias: 54.61,16.51
N$25  (via drill 1.02)
  other vias: 52.07,16.51
N$26  (via drill 1.02)
  other vias: 49.53,16.51
N$27  (via drill 1.02)
  other vias: 46.99,16.51
N$28  (via drill 1.02)
  other vias: 44.45,16.51
N$29  (via drill 1.02)
  other vias: 41.91,16.51
N$30  (via drill 1.02)
  other vias: 39.37,16.51
N$31  (via drill 1.02)
  other vias: 36.83,21.59
N$32  (via drill 1.02)
  other vias: 44.45,21.59
N$33  (via drill 1.02)
  other vias: 57.15,24.13
N$34  (via drill 1.02)
  other vias: 36.83,19.05
N$35  (via drill 1.02)
  other vias: 34.29,19.05
N$36  (via drill 1.02)
  other vias: 31.75,19.05
N$37  (via drill 1.02)
  other vias: 36.83,24.13
N$38  (via drill 1.02)
  other vias: 59.69,19.05
N$39  (via drill 1.02)
  other vias: 57.15,19.05
N$40  (via drill 1.02)
  other vias: 54.61,19.05
N$41  (via drill 1.02)
  other vias: 52.07,19.05
N$42  (via drill 1.02)
  other vias: 49.53,19.05
N$43  (via drill 1.02)
  other vias: 46.99,19.05
N$44  (via drill 1.02)
  other vias: 44.45,19.05
N$45  (via drill 1.02)
  other vias: 41.91,19.05
N$46  (via drill 1.02)
  other vias: 39.37,19.05
N$47  (via drill 1.02)
  other vias: 57.15,13.97
N$48  (via drill 1.02)
  other vias: 44.45,24.13
N$49  (via drill 1.02)
  other vias: 57.15,21.59
N$50  (via drill 1.02)
  other vias: 34.29,26.67
N$51  (via drill 1.02)
  other vias: 34.29,24.13
N$52  (via drill 1.02)
  other vias: 34.29,21.59
N$53  (1 unrouted)
  Bottom 0.406: U$1.10 54.61,16.51 C21.2
N$54
  Bottom 0.406: Q3.3 Q4.2
N$55
  Bottom 0.406: Q5.2 R19.2
N$56  (via drill 1.02)
  other vias: 54.61,21.59
N$57  (via drill 1.02)
  other vias: 52.07,21.59
N$58  (via drill 1.02)
  other vias: 49.53,21.59
N$59  (via drill 1.02)
  other vias: 46.99,21.59
N$62  (via drill 1.02)
  other vias: 36.83,26.67
N$67
  Top 0.305: U2.P$14 2.29,16.26 1.52,17.02 1.52,33.02 2.29,33.78 R9.2
N$68
  Top 0.813: U2.P$9 18.41,16.51 JP1.3
N$69
  Top 0.813: JP1.2 17.14,13.97 U2.P$10
N$70
  Top 0.203: 17.27,33.4 14.22,33.4 13.59,34.04 13.59,35.01 U1.59
  Top 0.254: D1.1 18.85,32.51 R17.2 17.27,33.4 C5.1 17.27,35.31 WIZRST.1
N$74  (via drill 1.02)
  other vias: 49.53,24.13
N$75  (via drill 1.02)
  other vias: 31.75,26.67
N$81  (via drill 1.02)
  other vias: 31.75,24.13
N$82  (via drill 1.02)
  other vias: 36.83,29.21
N$83  (via drill 1.02)
  other vias: 34.29,29.21
N$84  (via drill 1.02)
  other vias: 31.75,29.21
N$85  (via drill 1.02)
  other vias: 36.83,31.75
N$86  (via drill 1.02)
  other vias: 59.69,26.67
N$87  (via drill 1.02)
  other vias: 57.15,26.67
N$88  (via drill 1.02)
  other vias: 54.61,26.67
N$89  (via drill 1.02)
  other vias: 52.07,26.67
N$90  (via drill 1.02)
  other vias: 49.53,26.67
N$91  (via drill 1.02)
  other vias: 46.99,26.67
N$98  (via drill 1.02)
  other vias: 34.29,31.75
N$99  (via drill 1.02)
  other vias: 31.75,31.75
N$100  (via drill 1.02)
  other vias: 36.83,34.29
N$101  (via drill 1.02)
  other vias: 34.29,34.29
N$102  (via drill 1.02)
  other vias: 59.69,29.21
N$103  (via drill 1.02)
  other vias: 57.15,29.21
N$104  (via drill 1.02)
  other vias: 54.61,29.21
N$105  (via drill 1.02)
  other vias: 52.07,29.21
N$106  (via drill 1.02)
  other vias: 49.53,29.21
N$107  (via drill 1.02)
  other vias: 46.99,29.21
N$108  (via drill 1.02)
  other vias: 44.45,29.21
N$109  (via drill 1.02)
  other vias: 41.91,29.21
N$110  (via drill 1.02)
  other vias: 39.37,29.21
N$111  (via drill 1.02)
  other vias: 31.75,34.29
N$112  (via drill 1.02)
  other vias: 41.91,26.67
N$113  (via drill 1.02)
  other vias: 59.69,24.13
N$114  (via drill 1.02)
  other vias: 36.83,36.83
N$115  (via drill 1.02)
  other vias: 34.29,36.83
N$116  (via drill 1.02)
  other vias: 31.75,36.83
N$117  (via drill 1.02)
  other vias: 36.83,39.37
N$118  (via drill 1.02)
  other vias: 59.69,31.75
N$119  (via drill 1.02)
  other vias: 57.15,31.75
N$120  (via drill 1.02)
  other vias: 54.61,31.75
N$121  (via drill 1.02)
  other vias: 52.07,31.75
N$122  (via drill 1.02)
  other vias: 49.53,31.75
N$123  (via drill 1.02)
  other vias: 46.99,31.75
N$124  (via drill 1.02)
  other vias: 44.45,31.75
N$125  (via drill 1.02)
  other vias: 41.91,31.75
N$126  (via drill 1.02)
  other vias: 39.37,31.75
N$127  (via drill 1.02)
  other vias: 34.29,39.37
N$128  (via drill 1.02)
  other vias: 41.91,24.13
N$129  (via drill 1.02)
  other vias: 59.69,21.59
N$130  (via drill 1.02)
  other vias: 31.75,39.37
N$131
  Top 0.305: LED7.A R7.2
N$134  (via drill 1.02)
  other vias: 59.69,34.29
N$135  (via drill 1.02)
  other vias: 57.15,34.29
N$136  (via drill 1.02)
  other vias: 54.61,34.29
N$137  (via drill 1.02)
  other vias: 52.07,34.29
N$138  (via drill 1.02)
  other vias: 49.53,34.29
N$139  (via drill 1.02)
  other vias: 46.99,34.29
N$140  (via drill 1.02)
  other vias: 44.45,34.29
N$141  (via drill 1.02)
  other vias: 41.91,34.29
N$142  (via drill 1.02)
  other vias: 39.37,34.29
N$144  (via drill 1.02)
  other vias: 41.91,21.59
N$145  (via drill 1.02)
  other vias: 44.45,26.67
N$150  (via drill 1.02)
  other vias: 59.69,36.83
N$151  (via drill 1.02)
  other vias: 57.15,36.83
N$152  (via drill 1.02)
  other vias: 54.61,36.83
N$153  (via drill 1.02)
  other vias: 52.07,36.83
N$154  (via drill 1.02)
  other vias: 49.53,36.83
N$155  (via drill 1.02)
  other vias: 46.99,36.83
N$156  (via drill 1.02)
  other vias: 44.45,36.83
N$157  (via drill 1.02)
  other vias: 41.91,36.83
N$158  (via drill 1.02)
  other vias: 39.37,36.83
N$160  (via drill 1.02)
  other vias: 39.37,26.67
N$161  (via drill 1.02)
  other vias: 52.07,24.13
N$166  (via drill 1.02)
  other vias: 59.69,39.37
N$167  (via drill 1.02)
  other vias: 57.15,39.37
N$168  (via drill 1.02)
  other vias: 54.61,39.37
N$169  (via drill 1.02)
  other vias: 52.07,39.37
N$170  (via drill 1.02)
  other vias: 49.53,39.37
N$171  (via drill 1.02)
  other vias: 46.99,39.37
N$172  (via drill 1.02)
  other vias: 44.45,39.37
N$173  (via drill 1.02)
  other vias: 41.91,39.37
N$174  (via drill 1.02)
  other vias: 39.37,39.37
N$176  (via drill 1.02)
  other vias: 39.37,24.13
N$177  (via drill 1.02)
  other vias: 46.99,24.13
N$182  (via drill 1.02)
  other vias: 62.23,13.97
N$183  (via drill 1.02)
  other vias: 62.23,16.51
N$184  (via drill 1.02)
  other vias: 62.23,19.05
N$185  (via drill 1.02)
  other vias: 62.23,21.59
N$186  (via drill 1.02)
  other vias: 62.23,24.13
N$187  (via drill 1.02)
  other vias: 62.23,26.67
N$188  (via drill 1.02)
  other vias: 62.23,29.21
N$189  (via drill 1.02)
  other vias: 62.23,31.75
N$190  (via drill 1.02)
  other vias: 62.23,34.29
N$191  (via drill 1.02)
  other vias: 62.23,36.83
N$192  (via drill 1.02)
  other vias: 64.77,39.37
N$193  (via drill 1.02)
  other vias: 64.77,13.97
N$194  (via drill 1.02)
  other vias: 64.77,16.51
N$195  (via drill 1.02)
  other vias: 64.77,19.05
N$196  (via drill 1.02)
  other vias: 64.77,21.59
N$197  (via drill 1.02)
  other vias: 64.77,24.13
N$198  (via drill 1.02)
  other vias: 64.77,26.67
N$199  (via drill 1.02)
  other vias: 64.77,29.21
N$200  (via drill 1.02)
  other vias: 64.77,31.75
N$201  (via drill 1.02)
  other vias: 64.77,34.29
N$202  (via drill 1.02)
  other vias: 64.77,36.83
N$203  (via drill 1.02)
  other vias: 62.23,39.37
N$321
  Top 0.305: R11.2 R10.1 C10.1
N$322
  Top 0.203: U1.1 13.97,47.5 13.97,48.01 12.45,49.53 12.45,50.16 11.05,51.56 R14.2
N$323
  Top 0.305: R5.1 LED5.C
N$325
  Top 0.305: R6.1 LED6.C
N$327
  Top 0.305: R4.1 LED4.C
N$328
  Top 0.305: R3.1 LED3.C
N$329
  Top 0.305: R2.1 LED2.C
N$330
  Top 0.305: R1.1 LED1.C
N$332
  Top 0.305: U2.P$12 2.79,26.92 2.29,27.43 2.29,31.75 R8.2
PLEDGND
  Bottom 0.406: Q4.1 JP5.3
PLEDIN
  Bottom 0.406: Q3.2 JP4.3
PLEDOUT
  Bottom 0.406: R18.2 67.31,34.29 67.31,21.59 JP5.4
PWRBTN
  Bottom 0.406: Q5.1 JP4.2 JP5.2
RESET  (via drill 0.5)
  Top 0.254: D1.3 19.86,34.12 19.81,34.16 v19.81,33.27
  Top 0.305: 23.88,2.92 v23.88,4.83
  Top 0.406: S1.3 23.88,2.92 S1.4 27.18,2.54 H1.1
  Bottom 0.305: v23.88,4.83 18.8,9.91 18.8,32.26 v19.81,33.27
  Bottom 0.61: H1.1 SP1.1
RX
  Bottom 0.406: U$1.6 JP3.3
RXIN  (via drill 0.5)
  Top 0.203: v13.21,41.15 13.21,41.66 12.83,42.04 12.83,42.93 12.45,43.31 12.45,44.07 11.96,44.55 U1.6
  Top 0.305: R11.1 19.81,25.65 18.16,27.3 U2.P$2
  Bottom 0.305: v13.21,41.15 19.81,41.15 20.83,40.13 20.83,35.81 20.32,35.31 17.53,35.31 16.76,34.54 16.76,31.5 14.22,28.96 13.97,28.7 U2.P$2
RXIP  (via drill 0.5)
  Top 0.203: v13.72,42.42 13.72,42.8 12.95,43.56 12.95,44.32 12.36,44.92 U1.5
  Top 0.305: U2.P$1 18.54,28.57 19.94,27.18 R10.2
  Bottom 0.305: v13.72,42.42 19.56,42.42 21.59,40.39 21.59,35.56 20.57,34.54 18.03,34.54 17.53,34.04 17.53,29.57 U2.P$1
RXLED
  Top 0.203: U1.72 20.47,41.24 21.34,40.39 21.34,39.88 22.35,38.86 R2.2
SEN
  Top 0.203: Q1.3 1.78,47.07 1.52,46.74 1.52,43.69 1.78,43.43 R16.1 2.79,42.93 2.79,40.89 3.25,40.44 U1.31
SPDLED
  Top 0.203: U1.67 19.18,39.24 19.56,38.86 20.07,38.86 20.83,38.1 20.83,37.59 21.34,37.08 21.34,36.32 21.84,35.81 21.84,35.05 R5.2
TX
  Bottom 0.406: U$1.7 JP3.2
TXLED
  Top 0.203: U1.73 20.83,41.64 22.1,40.39 R1.2
TXON  (via drill 0.5)
  Top 0.203: U1.9 10.76,42.84 9.65,41.73 9.65,37.97 v10.67,36.96
  Top 0.305: U2.P$6 18.16,22.23 19.81,20.57 R13.1
  Bottom 0.305: v10.67,36.96 10.67,36.58 13.21,34.04 13.21,30.1 10.79,27.69 10.79,24 12.57,22.23 U2.P$6
TXOP  (via drill 0.5)
  Top 0.203: v12.06,36.96 10.16,38.86 10.16,41.4 11.16,42.4 U1.8
  Top 0.305: U2.P$5 18.41,23.5 19.81,22.1 R12.2
  Bottom 0.305: v12.06,36.96 13.97,35.05 13.97,29.72 11.81,27.56 11.81,24.89 13.21,23.5 U2.P$5
VCC3V3
  Bottom 0.61: H1.2 SP1.2
VIN
  Bottom 0.813: H1.6 SP1.6 45.72,8.64 44.7,9.65 29.59,9.65 28.83,10.41 28.83,17.78 27.56,19.05 JP1.4
XTLN
  Top 0.203: U1.75 18.31,42.44 19.56,43.69 R15.2
  Top 0.305: R15.2 C13.1 19.56,49.53 X1.2
XTLP
  Top 0.203: U1.76 17.18,42.84 18.03,43.69 R15.1
  Top 0.305: X1.1 16.38,50.16 18.03,48.51 C12.1 R15.1

### Text on the board
tPlace: A | GND | D12 | D10 | D8 | D6 | D4 | D2 | D0 | REF | D13 | D11 | D9 | D7 | D5 | D3 | D1 | 5V | (D2INT) | TX | WIZ | RST | RX | COL | FDX | 100 | LNK | D2INT | ! | VIN | - + | PoE | 7-48V | GND | www.freetronics.com | GND | freetronics | Freetronics Ethernet Shield v1.1 | 3V3 | GND | VIN | A1 | A3 | A5 | RST | 5V | GND | A0 | A2 | A4 | PWR | RESET
bPlace: www.freetronics.com/ethernet-shield | A | GND | D12 | D10 | D8 | D6 | D4 | D2 | D0 | REF | D13 | D11 | D9 | D7 | D5 | D3 | D1 | freetronics | 5V | (c) 2010 Freetronics | SKU: SH-ETHERNET | GND | 3V3 | GND | VIN | A1 | A3 | A5 | RST | 5V | GND | A0 | A2 | A4